# EAGLE design RelaisBoard_REV_B (EAGLE 5.11)
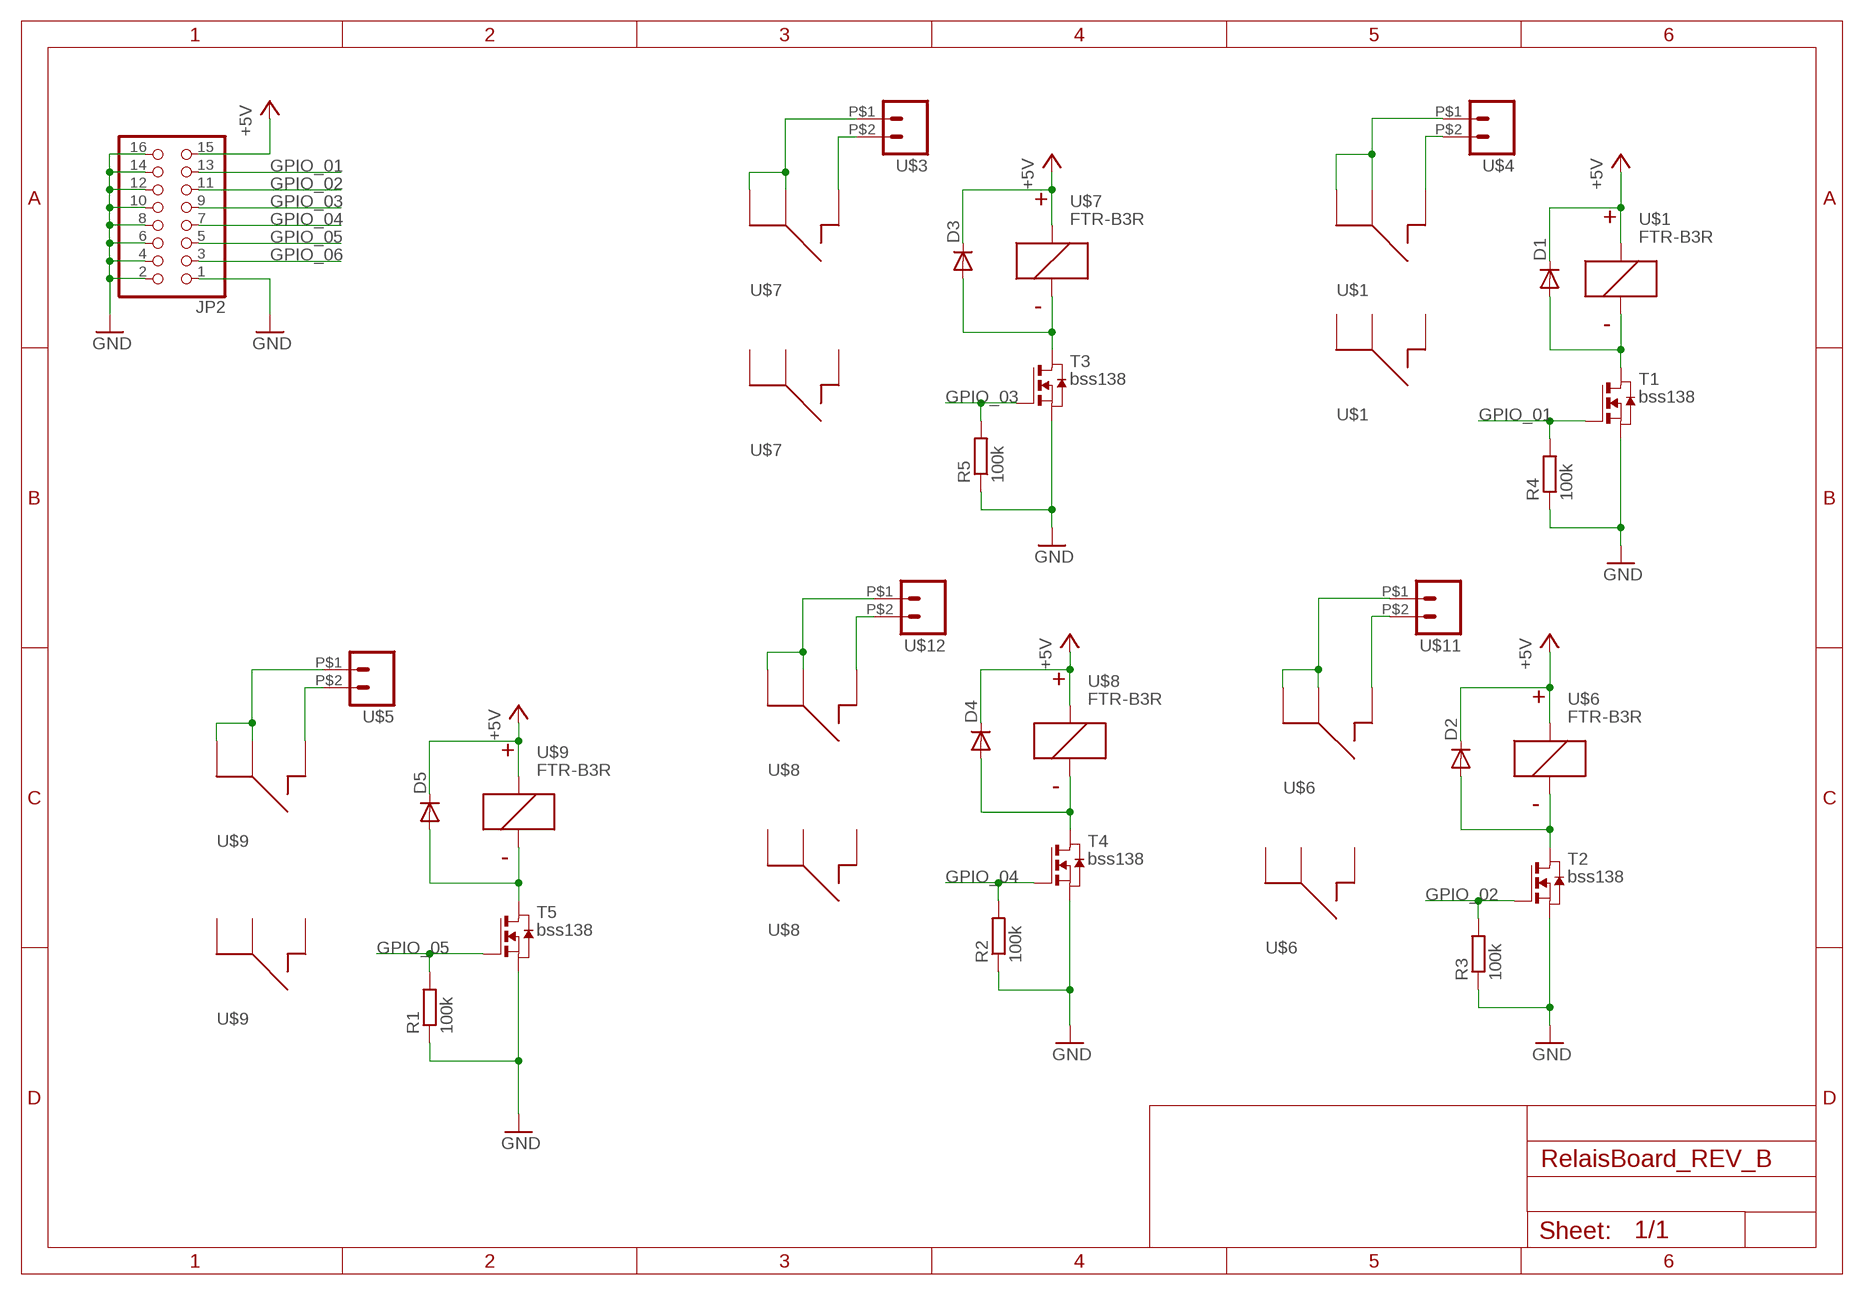
[diagram p0: schematic, sheet 1]

## Parts
D1  DIODE-MINIMELF  [MINIMELF]
D2  DIODE-MINIMELF  [MINIMELF]
D3  DIODE-MINIMELF  [MINIMELF]
D4  DIODE-MINIMELF  [MINIMELF]
D5  DIODE-MINIMELF  [MINIMELF]
JP2  PINHD-2X8  [2X08]
R1  100k  R-EU_R0603  [R0603]
R2  100k  R-EU_R0603  [R0603]
R3  100k  R-EU_R0603  [R0603]
R4  100k  R-EU_R0603  [R0603]
R5  100k  R-EU_R0603  [R0603]
T1  bss138  NMOSSOT23  [SOT-23]
T2  bss138  NMOSSOT23  [SOT-23]
T3  bss138  NMOSSOT23  [SOT-23]
T4  bss138  NMOSSOT23  [SOT-23]
T5  bss138  NMOSSOT23  [SOT-23]
U$1  FTR-B3R  [FTR-B3S]
U$3  PSS254_2GERADE  [02G]
U$4  PSS254_2GERADE  [02G]
U$5  PSS254_2GERADE  [02G]
U$6  FTR-B3R  [FTR-B3S]
U$7  FTR-B3R  [FTR-B3S]
U$8  FTR-B3R  [FTR-B3S]
U$9  FTR-B3R  [FTR-B3S]
U$11  PSS254_2GERADE  [02G]
U$12  PSS254_2GERADE  [02G]

## Nets
+5V: D1.C D2.C D3.C D4.C D5.C JP2.15 U$1.1 U$6.1 U$7.1 U$8.1 U$9.1
GND: JP2.1 JP2.2 JP2.4 JP2.6 JP2.8 JP2.10 JP2.12 JP2.14 JP2.16 R1.1 R2.1 R3.1 R4.1 R5.1 T1.2(S) T2.2(S) T3.2(S) T4.2(S) T5.2(S)
GPIO_01: JP2.13 R4.2 T1.3(G)
GPIO_02: JP2.11 R3.2 T2.3(G)
GPIO_03: JP2.9 R5.2 T3.3(G)
GPIO_04: JP2.7 R2.2 T4.3(G)
GPIO_05: JP2.5 R1.2 T5.3(G)
GPIO_06: JP2.3
N$1: U$1.2 U$1.3 U$4.P$1
N$2: U$1.4 U$4.P$2
N$3: D2.A T2.1(D) U$6.8
N$4: D1.A T1.1(D) U$1.8
N$5: D3.A T3.1(D) U$7.8
N$6: U$3.P$1 U$7.2 U$7.3
N$7: U$3.P$2 U$7.4
N$8: D4.A T4.1(D) U$8.8
N$9: U$8.2 U$8.3 U$12.P$1
N$10: U$8.4 U$12.P$2
N$11: D5.A T5.1(D) U$9.8
N$12: U$5.P$1 U$9.2 U$9.3
N$13: U$5.P$2 U$9.4
N$14: U$6.4 U$11.P$2
N$17: U$6.2 U$6.3 U$11.P$1
Unconnected: U$1.5 U$1.6 U$1.7 U$6.5 U$6.6 U$6.7 U$7.5 U$7.6 U$7.7 U$8.5 U$8.6 U$8.7 U$9.5 U$9.6 U$9.7

## Library data of the parts
D1-D5 = diode:DIODE-: DIODE
JP2 = pinhead:PINHD-2X8: PIN HEADER
R1-R5 = rcl:R-EU_: RESISTOR, European symbol
T1-T5 = zetex:NMOSSOT23: MOS FET
U$1 U$6-U$9 = FTR-3BS:FTR-B3R
U$3-U$5 U$11 U$12 = con-pss254_reichelt:PSS254_2

## Board
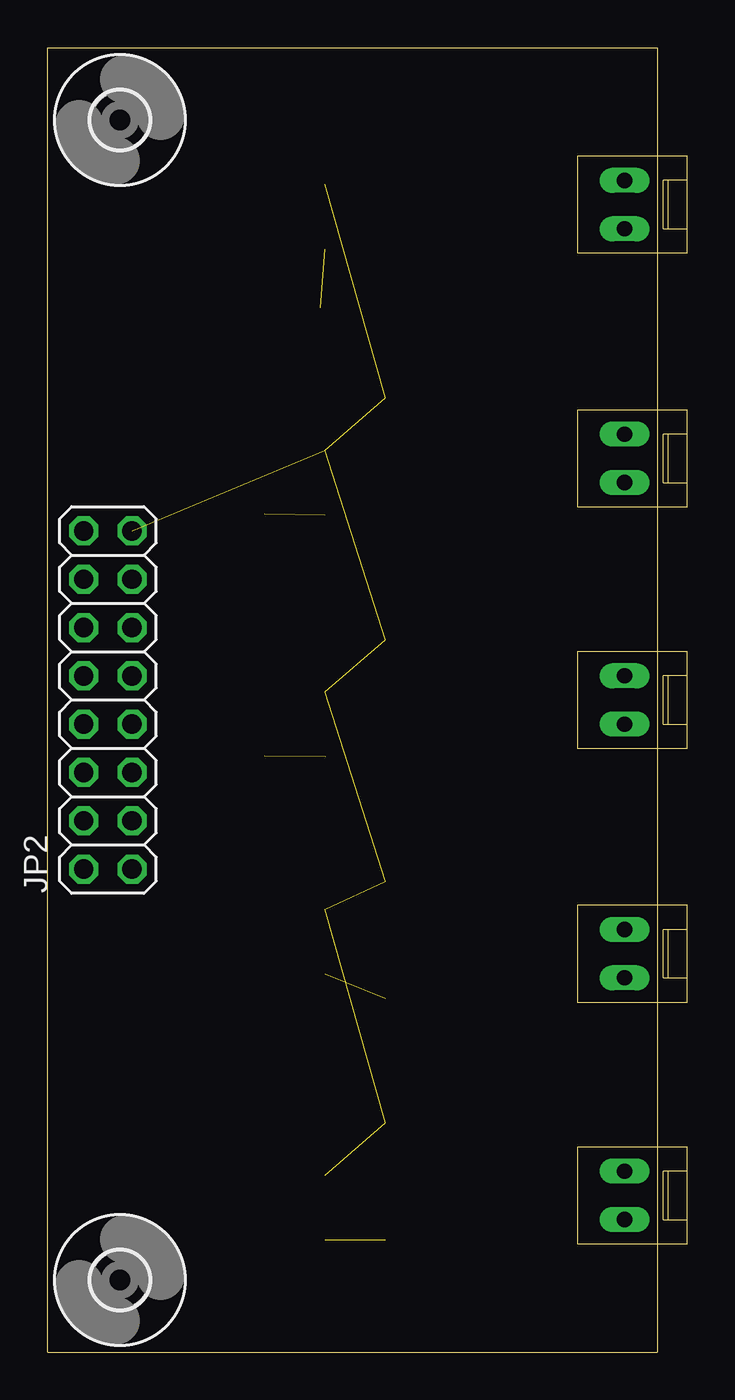
[diagram p1: board, top side]
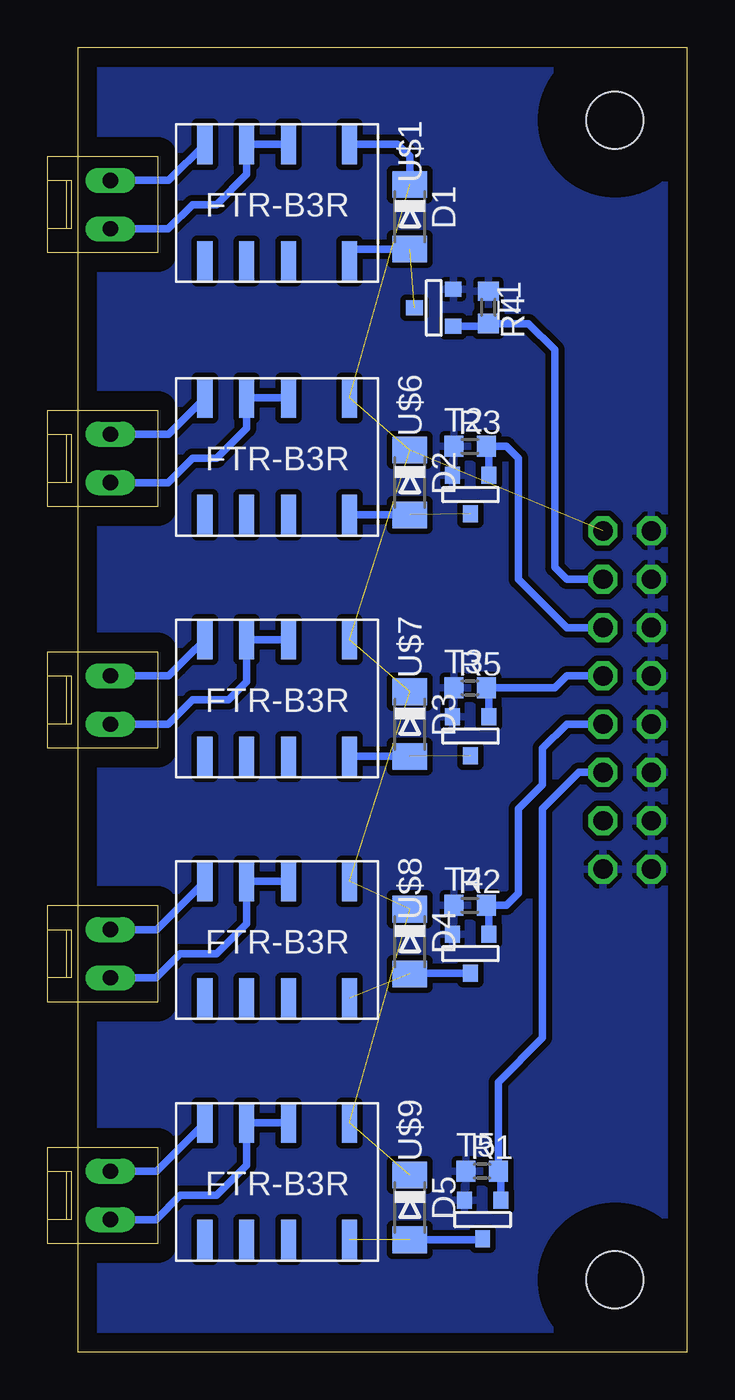
[diagram p2: board, bottom side, seen from below]

Size 32.07 x 68.58 mm. Coordinates in mm from the lower left corner, seen from the top.
Outline: 0,0 0,68.58 32.07,68.58 32.07,0 0,0
Copper layers (1*16): Top 0.035mm / dielectric 1.5mm / Bottom 0.035mm
Design rules "default *": minimum track width 10mil, minimum drill 24mil, track to track 12mil, track to pad 12mil, pad to pad 12mil, via to via 12mil, smd to smd 12mil, copper to edge 40mil, drill to drill 8mil, minimum pad ring 10mil, minimum via ring 8mil, stop-mask expansion 4mil, vias tented up to drill 0mil, thermal gap 10mil

### Footprints (pad centres in the part's own frame; a part is rotated, then mirrored left to right if it is on the bottom)
MINIMELF = smd 1.4 x 1.8: A 1.7,0; C -1.7,0
2X08 = drill 1.016 octagon: 1 -8.89,-1.27; 2 -8.89,1.27; 3 -6.35,-1.27; 4 -6.35,1.27; 5 -3.81,-1.27; 6 -3.81,1.27; 7 -1.27,-1.27; 8 -1.27,1.27; 9 1.27,-1.27; 10 1.27,1.27; 11 3.81,-1.27; 12 3.81,1.27; 13 6.35,-1.27; 14 6.35,1.27; 15 8.89,-1.27; 16 8.89,1.27
R0603 = smd 1 x 1.1: 1 -0.85,0; 2 0.85,0
SOT-23 = smd 0.787 x 0.889: 1 0.025,-1.016; 2 -0.94,1.016; 3 0.991,1.016
FTR-B3S = smd 0.8 x 2.08: 1 0,0; 2 3.2,0; 3 5.4,0; 4 7.6,0; 5 7.6,6.14; 6 5.4,6.14; 7 3.2,6.14; 8 0,6.14
3,0 = hole 3: 0,0
02G = drill 0.8 long: P$1 1.27,3.31; P$2 3.81,3.31

### Placement (x,y rotation side)
D1  14.6,59.69 270 bottom
D2  14.6,45.72 270 bottom
D3  14.6,33.02 270 bottom
D4  14.6,21.59 270 bottom
D5  14.6,7.62 270 bottom
JP2  3.17,34.29 90 top
R1  10.79,9.53 0 bottom
R2  11.43,23.5 0 bottom
R3  11.43,47.62 0 bottom
R4  10.48,54.93 270 bottom
R5  11.43,34.92 0 bottom
T1  13.33,54.93 270 bottom
T2  11.43,45.09 0 bottom
T3  11.43,32.38 0 bottom
T4  11.43,20.95 0 bottom
T5  10.79,6.99 0 bottom
U$1  17.78,63.5 180 bottom
U$2  [3,0]  3.81,64.77 0 top
U$3  33.65,31.75 90 top
U$4  33.65,57.78 90 top
U$5  33.65,5.71 90 top
U$6  17.78,50.16 180 bottom
U$7  17.78,37.47 180 bottom
U$8  17.78,24.77 180 bottom
U$9  17.78,12.06 180 bottom
U$10  [3,0]  3.81,3.81 0 top
U$11  33.65,44.45 90 top
U$12  33.65,18.41 90 top

### Tracks (layer width: path | path; a pad name or v marks a point on that pad's centre or on a via)
+5V  (9 unrouted)
  Bottom 0.406: D1.C 14.6,62.87 15.24,63.5 U$1.1
GND
  pour Bottom: 40,76.2 40,-4.45 -1.91,-4.45 -1.91,76.2
GPIO_01
  Bottom 0.406: JP2.13 6.35,40.64 6.98,41.27 6.98,52.7 8.36,54.08 R4.2 10.62,53.94 T1.3
GPIO_02
  Bottom 0.406: JP2.11 6.35,38.1 8.89,40.64 8.89,46.99 9.52,47.62 R3.2 10.44,47.48 T2.3
GPIO_03
  Bottom 0.406: JP2.9 6.35,35.56 6.98,34.92 R5.2 10.44,34.78 T3.3
GPIO_04
  Bottom 0.406: JP2.7 6.35,33.02 7.62,31.75 7.62,29.84 8.89,28.57 8.89,24.13 9.52,23.5 R2.2 10.44,23.35 T4.3
GPIO_05
  Bottom 0.406: JP2.5 5.71,30.48 7.62,28.57 7.62,16.54 9.94,14.21 R1.2 9.8,9.38 T5.3
N$1
  Bottom 0.406: U$1.2 U$1.3 23.18,61.91 24.77,60.33 26.03,60.33 27.3,59.05 U$4.P$1
N$2
  Bottom 0.406: U$4.P$2 27.28,61.59 U$1.4
N$3  (1 unrouted)
  Bottom 0.406: D2.A U$6.8 arc90 U$6.8
N$4  (1 unrouted)
  Bottom 0.406: U$1.8 17.78,57.99 D1.A 14.6,58.08
N$5  (1 unrouted)
  Bottom 0.406: U$7.8 D3.A arc90 D3.A
N$6
  Bottom 0.406: U$7.2 U$7.3 23.18,35.24 24.13,34.29 26.03,34.29 27.3,33.02 U$3.P$1
N$7
  Bottom 0.406: U$7.4 26.34,36.5 26.8,36.04 27.28,35.56 U$3.P$2
N$8  (1 unrouted)
  Bottom 0.406: T4.1 14.6,19.94 D4.A
N$9
  Bottom 0.406: U$8.2 U$8.3 23.18,22.54 24.77,20.95 26.67,20.95 27.94,19.68 U$12.P$1
N$10
  Bottom 0.406: U$12.P$2 27.92,22.23 U$8.4
N$11  (1 unrouted)
  Bottom 0.406: D5.A 10.77,5.92 T5.1
N$12
  Bottom 0.406: U$9.2 U$9.3 23.18,9.84 24.77,8.26 26.67,8.26 27.94,6.99 U$5.P$1
N$13
  Bottom 0.406: U$5.P$2 27.92,9.53 U$9.4
N$14
  Bottom 0.406: U$11.P$2 27.28,48.26 U$6.4
N$17
  Bottom 0.406: U$6.2 U$6.3 23.18,48.58 24.77,46.99 26.03,46.99 27.3,45.72 U$11.P$1